# Altium schematic sheet crw_sensor.SchDoc
size A
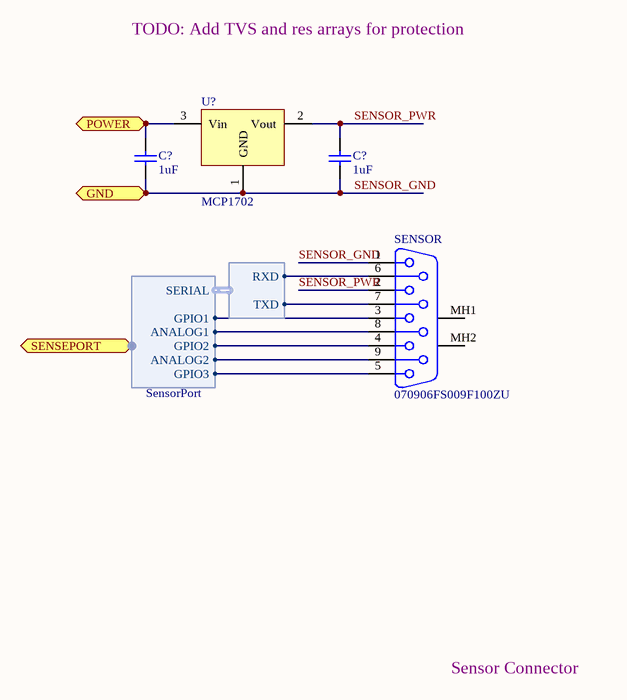
[diagram p0: crw_sensor.SchDoc]

## Parts
(Parts that share a designator on the sheet are numbered #1, #2 ... from top to bottom, then left to right.)
C?#1  value 1uF  [0805]  (hidden comment: C0805)
C?#2  value 1uF  [0805]  (hidden comment: C0805)
SENSOR  070906FS009F100ZU  [070906FS009]
U?  MCP1702  [SO-G3]

## Ports
GND, POWER, SENSEPORT (harness SensorPort)

## Harnesses
SensorPort: ANALOG1, ANALOG2, GPIO1, GPIO2, GPIO3, SERIAL
Serial: RXD, TXD

## Nets
POWER: C?#1.2 U?.3(Vin) ; port POWER
SENSOR_GND: C?#1.1 C?#2.1 SENSOR.1 U?.1(GND) ; port GND
SENSOR_PWR: C?#2.2 SENSOR.2 U?.2(Vout)
NetSENSOR_3: SENSOR.3 ; port SENSEPORT.GPIO1
NetSENSOR_4: SENSOR.4 ; port SENSEPORT.GPIO2
NetSENSOR_5: SENSOR.5 ; port SENSEPORT.GPIO3
NetSENSOR_6: SENSOR.6 ; harness Serial.RXD
NetSENSOR_7: SENSOR.7 ; harness Serial.TXD
NetSENSOR_8: SENSOR.8 ; port SENSEPORT.ANALOG1
NetSENSOR_9: SENSOR.9 ; port SENSEPORT.ANALOG2

Not connected (* = marked no-connect by the designer): SENSOR MH1 MH2

## Notes on the sheet
- TODO: Add TVS and res arrays for protection
- Sensor Connector

## Library data of the parts
C?#1 C?#2 = C0805: Ceramic Chip Capacitor - Standard; Note: Footprint corresponds to dimensions for bulk cassette packaging. This case size has tightened tolerances.; Published: 17-Jul-2002; LatestRevisionDate: 19-Mar-2004; LatestRevisionNote: Silkscreen size reduced.; DatasheetDocument: Mar-2001; PackageDocument: Mar-2001; PackageReference: 0805; Publisher: Altium Limited; Code_JEITA: 0805; Code_IPC: 2012[0805]; ComponentLink1Description: Manufacturer Link; ComponentLink1URL: http://www.kemet.com/; ComponentLink2Description: Datasheet; ComponentLink2URL: http://www.kemet.com/kemet/web/homepage/kechome.nsf/vapubfilesname/F3102TA.pdf/$file/F3102TA.pdf
SENSOR = 070906FS009F100ZU: Ultra Thin D-Sub, Straight Dip Type, Female Connector, THT, 9 Position, 2.2mm Pin Length; PCB_Layout: Complies with manufacturer's recommendation.; DrillSize: Corresponds to nominal value.; Published: 26-Sep-2008; DatasheetVersion: May-2003; PackageVersion: revK, Nov-2007; PackageReference: 070906FS009; Publisher: Altium Limited; PackageDescription: Connector; D-Sub, Thru-Hole; 9 Position; Vertical; Body 30.81 x 9.60 x 8.20 mm (LxWxH); ComponentLink1Description: Manufacturer Link; ComponentLink1URL: http://www.suyin.com/; ComponentLink2Description: Datasheet; ComponentLink2URL: http://www.suyin.at/pdf/i_o/d_sub/female/straight/070906FS.pdf
U? = MCP1702: 2 uA Low Dropout Positive Voltage Regulator